# Altium schematic sheet FMC_ADC_top.SchDoc
size A3
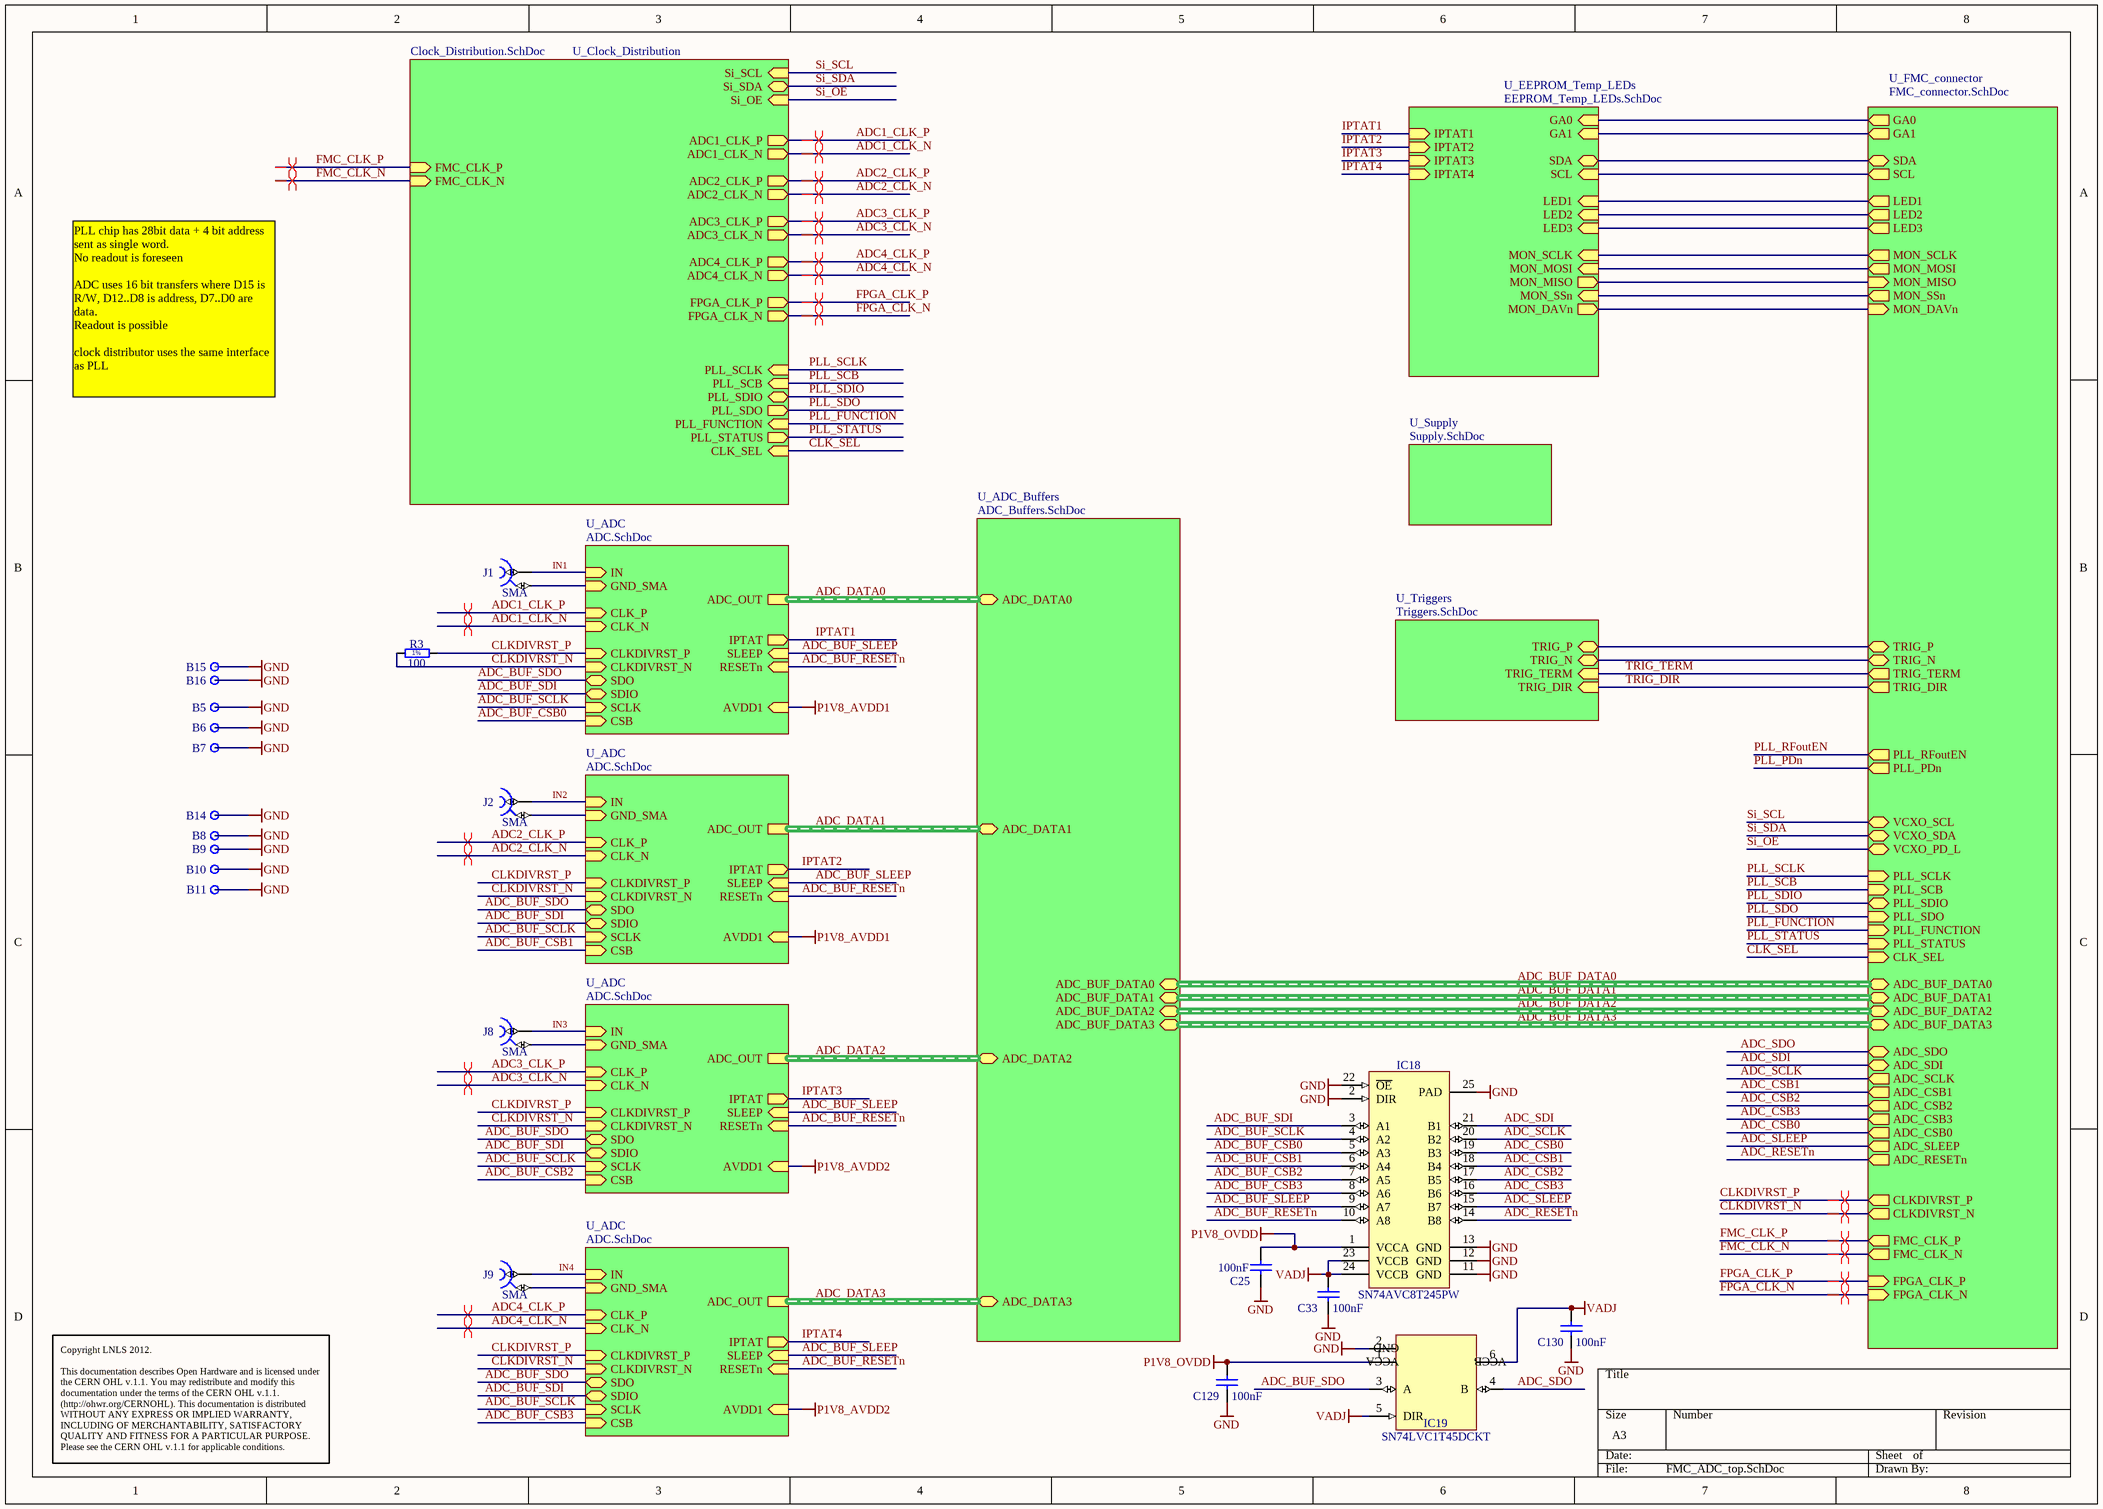
[diagram p0: FMC_ADC_top.SchDoc]

## Parts
B5  Plated Hole  [MTG240_400_M]  (value not drawn)
B6  Plated Hole  [MTG240_400_M]  (value not drawn)
B7  Plated Hole  [MTG240_400_M]  (value not drawn)
B8  Plated Hole  [MTG240_400_M]  (value not drawn)
B9  Plated Hole  [MTG240_400_M]  (value not drawn)
B10  Plated Hole  [MTG240_400_M]  (value not drawn)
B11  Plated Hole  [MTG240_400_M]  (value not drawn)
B14  Plated Hole  [MTG240_400_M]  (value not drawn)
B15  Plated Hole  [MTG240_400_M]  (value not drawn)
B16  Plated Hole  [MTG240_400_M]  (value not drawn)
C25  100nF  [CAPC0603X33N]
C33  100nF  [CAPC0603X33N]
C129  100nF  [CAPC0603X33N]
C130  100nF  [CAPC0603X33N]
IC18  SN74AVC8T245PW  [SOP65P640X120-24N]
IC19  SN74LVC1T45DCKT  [SOT65P210X110-6N]
J1  SMA  [AMPHENOL_901-143_IN BOARD]
J2  SMA  [AMPHENOL_901-143_IN BOARD]
J8  SMA  [AMPHENOL_901-143_IN BOARD]
J9  SMA  [AMPHENOL_901-143_IN BOARD]
R3  100  [RESC1005X40N]

## Sub-sheets
U_ADC = ADC.SchDoc: ADC_OUT (harness ADC_OUT_Harness), SLEEP (in), CLK_P (in), CLK_N (in), IPTAT (out), RESETn (in), CLKDIVRST_P (in), CLKDIVRST_N (in), SDO (bidir), SDIO (bidir), SCLK (in), CSB (in), IN (in), AVDD1 (in), GND_SMA (in)
U_ADC = ADC.SchDoc: ADC_OUT (harness ADC_OUT_Harness), SLEEP (in), CLK_P (in), CLK_N (in), IPTAT (out), RESETn (in), CLKDIVRST_P (in), CLKDIVRST_N (in), SDO (bidir), SDIO (bidir), SCLK (in), CSB (in), IN (in), AVDD1 (in), GND_SMA (in)
U_ADC = ADC.SchDoc: ADC_OUT (harness ADC_OUT_Harness), SLEEP (in), CLK_P (in), CLK_N (in), IPTAT (out), RESETn (in), CLKDIVRST_P (in), CLKDIVRST_N (in), SDO (bidir), SDIO (bidir), SCLK (in), CSB (in), IN (in), AVDD1 (in), GND_SMA (in)
U_ADC = ADC.SchDoc: ADC_OUT (harness ADC_OUT_Harness), SLEEP (in), CLK_P (in), CLK_N (in), IPTAT (out), RESETn (in), CLKDIVRST_P (in), CLKDIVRST_N (in), SDO (bidir), SDIO (bidir), SCLK (in), CSB (in), IN (in), AVDD1 (in), GND_SMA (in)
U_ADC_Buffers = ADC_Buffers.SchDoc: ADC_DATA1 (harness ADC_OUT_Harness), ADC_DATA2 (harness ADC_OUT_Harness), ADC_DATA3 (harness ADC_OUT_Harness), ADC_BUF_DATA1 (harness ADC_OUT_Harness), ADC_BUF_DATA2 (harness ADC_OUT_Harness), ADC_BUF_DATA3 (harness ADC_OUT_Harness), ADC_BUF_DATA0 (harness ADC_OUT_Harness), ADC_DATA0 (harness ADC_OUT_Harness)
U_Clock_Distribution = Clock_Distribution.SchDoc: ADC1_CLK_P (out), ADC1_CLK_N (out), ADC2_CLK_P (out), ADC2_CLK_N (out), ADC3_CLK_P (out), ADC3_CLK_N (out), ADC4_CLK_P (out), ADC4_CLK_N (out), FPGA_CLK_P (out), FPGA_CLK_N (out), FMC_CLK_P (in), FMC_CLK_N (in), Si_SDA (bidir), Si_SCL (in), Si_OE (in), PLL_SCLK (in), PLL_SCB (in), PLL_SDIO (bidir), PLL_SDO (out), PLL_FUNCTION (in), PLL_STATUS (out), CLK_SEL (in)
U_EEPROM_Temp_LEDs = EEPROM_Temp_LEDs.SchDoc: LED1 (in), LED3 (in), SDA (bidir), SCL (in), GA0 (in), GA1 (in), IPTAT1 (in), IPTAT2 (in), IPTAT3 (in), IPTAT4 (in), MON_SCLK (in), MON_MOSI (in), MON_MISO (out), MON_SSn (in), MON_DAVn (out), LED2 (in)
U_FMC_connector = FMC_connector.SchDoc: ADC_BUF_DATA1 (harness ADC_OUT_Harness), ADC_BUF_DATA2 (harness ADC_OUT_Harness), ADC_BUF_DATA3 (harness ADC_OUT_Harness), ADC_BUF_DATA0 (harness ADC_OUT_Harness), ADC_SDO (bidir), ADC_SDI (bidir), ADC_SCLK (out), ADC_CSB1 (out), ADC_CSB2 (out), ADC_CSB3 (out), ADC_CSB0 (out), ADC_RESETn (out), CLKDIVRST_P (out), CLKDIVRST_N (out), FMC_CLK_P (out), FMC_CLK_N (out), FPGA_CLK_P (in), FPGA_CLK_N (in), GA0 (out), GA1 (out), SDA (bidir), SCL (out), VCXO_SCL (bidir), VCXO_SDA (bidir), VCXO_PD_L (bidir), PLL_RFoutEN (out), PLL_PDn (out), TRIG_DIR (out), TRIG_TERM (out), PLL_SCLK (in), PLL_SCB (in), PLL_SDIO (bidir), PLL_SDO (in), PLL_FUNCTION (in), PLL_STATUS (in), CLK_SEL (in), TRIG_P (bidir), TRIG_N (bidir), MON_SCLK (out), MON_MOSI (out), MON_MISO (in), MON_SSn (out), MON_DAVn (in), ADC_SLEEP (out), LED1 (out), LED2 (out), LED3 (out)
U_Supply = Supply.SchDoc: no entries
U_Triggers = Triggers.SchDoc: TRIG_DIR (in), TRIG_N (bidir), TRIG_P (bidir), TRIG_TERM (in)

## Nets
GND: B5.1 B6.1 B7.1 B8.1 B9.1 B10.1 B11.1 B14.1 B15.1 B16.1 C25.2 C33.1 C129.1 C130.1 IC18.2(DIR) IC18.11(GND) IC18.12(GND) IC18.13(GND) IC18.22(~{OE}) IC18.25(PAD) IC19.2(GND)
P1V8_AVDD1: sheet U_ADC/AVDD1, sheet U_ADC/AVDD1
P1V8_AVDD2: sheet U_ADC/AVDD1, sheet U_ADC/AVDD1
P1V8_OVDD: C25.1 C129.2 IC18.1(VCCA) IC19.1(VCCA)
VADJ: C33.2 C130.2 IC18.23(VCCB) IC18.24(VCCB) IC19.5(DIR) IC19.6(VCCB)
ADC1_CLK_N: sheet U_ADC/CLK_N, sheet U_Clock_Distribution/ADC1_CLK_N
ADC1_CLK_P: sheet U_ADC/CLK_P, sheet U_Clock_Distribution/ADC1_CLK_P
ADC2_CLK_N: sheet U_Clock_Distribution/ADC2_CLK_N, sheet U_ADC/CLK_N
ADC2_CLK_P: sheet U_Clock_Distribution/ADC2_CLK_P, sheet U_ADC/CLK_P
ADC3_CLK_N: sheet U_Clock_Distribution/ADC3_CLK_N, sheet U_ADC/CLK_N
ADC3_CLK_P: sheet U_Clock_Distribution/ADC3_CLK_P, sheet U_ADC/CLK_P
ADC4_CLK_N: sheet U_Clock_Distribution/ADC4_CLK_N, sheet U_ADC/CLK_N
ADC4_CLK_P: sheet U_Clock_Distribution/ADC4_CLK_P, sheet U_ADC/CLK_P
ADC_BUF_CSB0: IC18.5(A3) ; sheet U_ADC/CSB
ADC_BUF_CSB1: IC18.6(A4) ; sheet U_ADC/CSB
ADC_BUF_CSB2: IC18.7(A5) ; sheet U_ADC/CSB
ADC_BUF_CSB3: IC18.8(A6) ; sheet U_ADC/CSB
ADC_BUF_RESETn: IC18.10(A8) ; sheet U_ADC/RESETn, sheet U_ADC/RESETn, sheet U_ADC/RESETn, sheet U_ADC/RESETn
ADC_BUF_SCLK: IC18.4(A2) ; sheet U_ADC/SCLK, sheet U_ADC/SCLK, sheet U_ADC/SCLK, sheet U_ADC/SCLK
ADC_BUF_SDI: IC18.3(A1) ; sheet U_ADC/SDIO, sheet U_ADC/SDIO, sheet U_ADC/SDIO, sheet U_ADC/SDIO
ADC_BUF_SDO: IC19.3(A) ; sheet U_ADC/SDO, sheet U_ADC/SDO, sheet U_ADC/SDO, sheet U_ADC/SDO
ADC_BUF_SLEEP: IC18.9(A7) ; sheet U_ADC/SLEEP, sheet U_ADC/SLEEP, sheet U_ADC/SLEEP, sheet U_ADC/SLEEP
ADC_CSB0: IC18.19(B3) ; sheet U_FMC_connector/ADC_CSB0
ADC_CSB1: IC18.18(B4) ; sheet U_FMC_connector/ADC_CSB1
ADC_CSB2: IC18.17(B5) ; sheet U_FMC_connector/ADC_CSB2
ADC_CSB3: IC18.16(B6) ; sheet U_FMC_connector/ADC_CSB3
ADC_RESETn: IC18.14(B8) ; sheet U_FMC_connector/ADC_RESETn
ADC_SCLK: IC18.20(B2) ; sheet U_FMC_connector/ADC_SCLK
ADC_SDI: IC18.21(B1) ; sheet U_FMC_connector/ADC_SDI
ADC_SDO: IC19.4(B) ; sheet U_FMC_connector/ADC_SDO
ADC_SLEEP: IC18.15(B7) ; sheet U_FMC_connector/ADC_SLEEP
CLK_SEL: sheet U_FMC_connector/CLK_SEL, sheet U_Clock_Distribution/CLK_SEL
CLKDIVRST_N: R3.1 ; sheet U_FMC_connector/CLKDIVRST_N, sheet U_ADC/CLKDIVRST_N, sheet U_ADC/CLKDIVRST_N, sheet U_ADC/CLKDIVRST_N, sheet U_ADC/CLKDIVRST_N
CLKDIVRST_P: R3.2 ; sheet U_FMC_connector/CLKDIVRST_P, sheet U_ADC/CLKDIVRST_P, sheet U_ADC/CLKDIVRST_P, sheet U_ADC/CLKDIVRST_P, sheet U_ADC/CLKDIVRST_P
FMC_CLK_N: sheet U_FMC_connector/FMC_CLK_N, sheet U_Clock_Distribution/FMC_CLK_N
FMC_CLK_P: sheet U_FMC_connector/FMC_CLK_P, sheet U_Clock_Distribution/FMC_CLK_P
FPGA_CLK_N: sheet U_FMC_connector/FPGA_CLK_N, sheet U_Clock_Distribution/FPGA_CLK_N
FPGA_CLK_P: sheet U_FMC_connector/FPGA_CLK_P, sheet U_Clock_Distribution/FPGA_CLK_P
IN1: J1.1 ; sheet U_ADC/IN
IN2: J2.1 ; sheet U_ADC/IN
IN3: J8.1 ; sheet U_ADC/IN
IN4: J9.1 ; sheet U_ADC/IN
IPTAT1: sheet U_EEPROM_Temp_LEDs/IPTAT1, sheet U_ADC/IPTAT
IPTAT2: sheet U_EEPROM_Temp_LEDs/IPTAT2, sheet U_ADC/IPTAT
IPTAT3: sheet U_EEPROM_Temp_LEDs/IPTAT3, sheet U_ADC/IPTAT
IPTAT4: sheet U_EEPROM_Temp_LEDs/IPTAT4, sheet U_ADC/IPTAT
PLL_FUNCTION: sheet U_FMC_connector/PLL_FUNCTION, sheet U_Clock_Distribution/PLL_FUNCTION
PLL_PDn: sheet U_FMC_connector/PLL_PDn
PLL_RFoutEN: sheet U_FMC_connector/PLL_RFoutEN
PLL_SCB: sheet U_FMC_connector/PLL_SCB, sheet U_Clock_Distribution/PLL_SCB
PLL_SCLK: sheet U_FMC_connector/PLL_SCLK, sheet U_Clock_Distribution/PLL_SCLK
PLL_SDIO: sheet U_FMC_connector/PLL_SDIO, sheet U_Clock_Distribution/PLL_SDIO
PLL_SDO: sheet U_FMC_connector/PLL_SDO, sheet U_Clock_Distribution/PLL_SDO
PLL_STATUS: sheet U_FMC_connector/PLL_STATUS, sheet U_Clock_Distribution/PLL_STATUS
Si_OE: sheet U_FMC_connector/VCXO_PD_L, sheet U_Clock_Distribution/Si_OE
Si_SCL: sheet U_FMC_connector/VCXO_SCL, sheet U_Clock_Distribution/Si_SCL
Si_SDA: sheet U_FMC_connector/VCXO_SDA, sheet U_Clock_Distribution/Si_SDA
TRIG_DIR: sheet U_FMC_connector/TRIG_DIR, sheet U_Triggers/TRIG_DIR
TRIG_TERM: sheet U_FMC_connector/TRIG_TERM, sheet U_Triggers/TRIG_TERM
NetJ1_2: J1.2 ; sheet U_ADC/GND_SMA
NetJ2_2: J2.2 ; sheet U_ADC/GND_SMA
NetJ8_2: J8.2 ; sheet U_ADC/GND_SMA
NetJ9_2: J9.2 ; sheet U_ADC/GND_SMA
(unnamed): sheet U_EEPROM_Temp_LEDs/LED1, sheet U_FMC_connector/LED1
(unnamed): sheet U_EEPROM_Temp_LEDs/LED3, sheet U_FMC_connector/LED3
(unnamed): sheet U_EEPROM_Temp_LEDs/SDA, sheet U_FMC_connector/SDA
(unnamed): sheet U_EEPROM_Temp_LEDs/SCL, sheet U_FMC_connector/SCL
(unnamed): sheet U_EEPROM_Temp_LEDs/GA0, sheet U_FMC_connector/GA0
(unnamed): sheet U_EEPROM_Temp_LEDs/GA1, sheet U_FMC_connector/GA1
(unnamed): sheet U_EEPROM_Temp_LEDs/MON_SCLK, sheet U_FMC_connector/MON_SCLK
(unnamed): sheet U_EEPROM_Temp_LEDs/MON_MOSI, sheet U_FMC_connector/MON_MOSI
(unnamed): sheet U_EEPROM_Temp_LEDs/MON_MISO, sheet U_FMC_connector/MON_MISO
(unnamed): sheet U_EEPROM_Temp_LEDs/MON_SSn, sheet U_FMC_connector/MON_SSn
(unnamed): sheet U_EEPROM_Temp_LEDs/MON_DAVn, sheet U_FMC_connector/MON_DAVn
(unnamed): sheet U_EEPROM_Temp_LEDs/LED2, sheet U_FMC_connector/LED2
(unnamed): sheet U_FMC_connector/TRIG_P, sheet U_Triggers/TRIG_P
(unnamed): sheet U_FMC_connector/TRIG_N, sheet U_Triggers/TRIG_N

## Buses and harness runs
harness ADC_BUF_DATA0 = sheet U_ADC_Buffers/ADC_BUF_DATA0 = sheet U_FMC_connector/ADC_BUF_DATA0
harness ADC_BUF_DATA1 = sheet U_ADC_Buffers/ADC_BUF_DATA1 = sheet U_FMC_connector/ADC_BUF_DATA1
harness ADC_BUF_DATA2 = sheet U_ADC_Buffers/ADC_BUF_DATA2 = sheet U_FMC_connector/ADC_BUF_DATA2
harness ADC_BUF_DATA3 = sheet U_ADC_Buffers/ADC_BUF_DATA3 = sheet U_FMC_connector/ADC_BUF_DATA3
harness ADC_DATA0 = sheet U_ADC/ADC_OUT = sheet U_ADC_Buffers/ADC_DATA0
harness ADC_DATA1 = sheet U_ADC/ADC_OUT = sheet U_ADC_Buffers/ADC_DATA1
harness ADC_DATA2 = sheet U_ADC/ADC_OUT = sheet U_ADC_Buffers/ADC_DATA2
harness ADC_DATA3 = sheet U_ADC/ADC_OUT = sheet U_ADC_Buffers/ADC_DATA3

## Layout directives
differential pair: ADC1_CLK_N, ADC1_CLK_P, ADC2_CLK_N, ADC2_CLK_P, ADC3_CLK_N, ADC3_CLK_P, ADC4_CLK_N, ADC4_CLK_P, CLKDIVRST_N, CLKDIVRST_P, FMC_CLK_N, FMC_CLK_P, FPGA_CLK_N, FPGA_CLK_P

## Notes on the sheet
- PLL chip has 28bit data + 4 bit address sent as single word.
  No readout is foreseen
  ADC uses 16 bit transfers where D15 is R/W, D12..D8 is address, D7..D0 are data.
  Readout is possible
  clock distributor uses the same interface as PLL
- Copyright LNLS 2012.
  This documentation describes Open Hardware and is licensed under the CERN OHL v.1.1. You may redistribute and modify this documentation under the terms of the CERN OHL v.1.1. (http://ohwr.org/CERNOHL). This documentation is distributed WITHOUT ANY EXPRESS OR IMPLIED WARRANTY, INCLUDING OF MERCHANTABILITY, SATISFACTORY QUALITY AND FITNESS FOR A PARTICULAR PURPOSE. Please see the CERN OHL v.1.1 for applicable conditions.
- (in symbol R0402_100R_1%_0.0625W_100PPM) 1%

## Library data of the parts
B5-B11 B14-B16 = PLATED_HOLE2.4_PAD4.0_M: Single Terminal Socket; Part Description: Plated Through Hole: Hole Dia.=2.4mm Pad Dia.=4.0mm Middle hole 2.8mm; Mounted: No; Part Number: PLATED_HOLE2.4_PAD4.0_M; Component Kind: Standard (No BOM); Component Type: Standard (No BOM); Pin Count: 1; Family: Plated Hole; Socket: No; SMD: No; Status: None; ComponentHeight: 0mm; Author: LNLS DIG FCS; CreateDate: 06/06/2016; LatestRevisionDate: 06/06/2016; PackageDescription: Plated Through Hole: Hole Dia.=2.4mm Pad Dia.=4.0mm Middle hole 2.8mm; Sense: No; HelpURL: Undefined
C25 C33 C129 C130 = CC0201_100NF_6.3V_10%_X5R: Non-polarised capacitor; Part Description: SMD Multilayer Chip Ceramic Capacitor; Manufacturer: GENERIC; Manufacturer1 Part Number: 02016D104KAT2A; Voltage: 6.3V; TC: X5R; Tolerance: ±10%; Table: Capacitors SMD; Part Number: CC0201_100NF_6.3V_10%_X5R; Component Kind: Standard; Component Type: Standard; Pin Count: 2; Value: 100nF; Status: Not Recommended; Manufacturer Part Number: CC0201_100NF_6.3V_10%_X5R; Case: 0201; Mounted: Yes; Socket: No; SMD: Yes; Manufacturer1 Example: AVX; Manufacturer1 ComponentHeight: 0.33mm; HelpURL: \\cern.ch\dfs\Applications\Altium\Datasheets\CC0201_X5R_AVX.pdf; Author: CERN DEM JLC; CreateDate: 03/12/2007; LatestRevisionDate: 03/12/2007; Sense: No
IC18 = SN74AVC8T245PW: 8-Bit Dual-Supply Bus Transceiver With Configurable Voltage Translation and 3-State Outputs; Manufacturer: TEXAS INSTRUMENTS; PressFit: No; Bonding: No; Part Number: SN74AVC8T245PW; Component Kind: Standard; Component Type: Standard; Device: SN74AVC8T245PW; PackageDescription: SOP, 0.65mm Pitch; 24 Pin, 4.40mm W X 7.80mm L X 1.20mm H Body, IPC Medium Density; Part Description: 8-Bit Dual-Supply Bus Transceiver With Configurable Voltage Translation and 3-State Outputs; Manufacturer Part Number: SN74AVC8T245PW; Pin Count: 24; Case: TSSOP24; Mounted: Yes; Socket: No; SMD: Yes; Sense: No; ComponentHeight: 1.2mm; Author: CERN DEM JLC; HelpURL: \\cern.ch\dfs\Applications\Altium\Datasheets\SN74AVC8T245PW.pdf; CreateDate: 07/03/2012; LatestRevisionDate: 07/03/2012
IC19 = SN74LVC1T45DCKT: Single-Bit Dual-Supply Bus Transceiver; Part Description: Single-Bit Dual-Supply Bus Transceiver with Configurable Voltage Translation and 3-State Outputs; Manufacturer: TEXAS INSTRUMENTS; PressFit: No; Bonding: No; Part Number: SN74LVC1T45DCKT; Component Kind: Standard; Component Type: Standard; Device: SN74LVC1T45DCKT; PackageDescription: SOT363, SC70-6, SOT, 0.65mm Pitch, 6 pin, 1.25mm W X 2.00mm L X 1.10mm H, IPC Medium Density; Manufacturer Part Number: SN74LVC1T45DCKT; Pin Count: 6; Case: SOT363; Mounted: Yes; Socket: No; SMD: Yes; Sense: No; ComponentHeight: 1.1mm; Author: CERN DEM JLC; HelpURL: \\cern.ch\dfs\Applications\Altium\Datasheets\SN74LVC1T45DCKT.pdf; CreateDate: 27/09/2010; LatestRevisionDate: 27/09/2010
J1 J2 J8 J9 = AMPHENOL_901-143-6RFX: Part Description: 50 Ohm Through Hole SMA 90 degrees PCB Jack; PressFit: No; Part Number: AMPHENOL_901-143-6RFX; Component Kind: Standard; Component Type: Standard; Pin Count: 5; Family: SMA; Mounted: Yes; Socket: No; SMD: No; Sense: No; Status: None; Manufacturer: AMPHENOL; Manufacturer Part Number: 901-143-6RFX; ComponentHeight: 10.0mm; Author: LNLS DIG GBMB; CreateDate: 31/05/2016; LatestRevisionDate: 31/05/2016
R3 = R0402_100R_1%_0.0625W_100PPM: Resistor - 1%; Part Description: General Purpose Thick Film Chip Resistor; Manufacturer: GENERIC; Manufacturer1 Part Number: 232270671001L; TC: ±100ppm/°C; Table: Resistors SMD; Part Number: R0402_100R_1%_0.0625W_100PPM; Component Kind: Standard; Component Type: Standard; Pin Count: 2; Value: 100; Status: Not recommended; Power: 0.0625W; Tolerance: ±1%; Manufacturer Part Number: R0402_100R_1%_0.0625W_100PPM; Case: 0402; Mounted: Yes; Socket: No; SMD: Yes; Manufacturer1 Example: YAGEO PHYCOMP; Manufacturer1 ComponentHeight: 0.4mm; HelpURL: \\cern.ch\dfs\Applications\Altium\Datasheets\R0402_Phycomp_RC0402.pdf; Author: CERN DEM JLC; CreateDate: 03/12/2007; LatestRevisionDate: 17/10/2012; Sense: No